# EAGLE design connector (EAGLE 9.5.2)
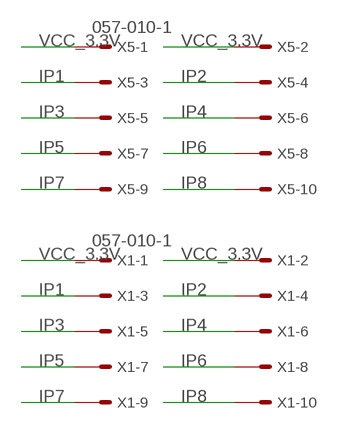
[diagram p0: schematic, sheet 1]

## Parts
X1  057-010-1  [057-010-1]
X5  057-010-1  [057-010-1]

## Nets
IP1: X1.3 X5.3
IP2: X1.4 X5.4
IP3: X1.5 X5.5
IP4: X1.6 X5.6
IP5: X1.7 X5.7
IP6: X1.8 X5.8
IP7: X1.9 X5.9
IP8: X1.10 X5.10
VCC_3.3V: X1.1 X1.2 X5.1 X5.2

## Library data of the parts
X1 X5 = con-panduit:057-010-: CONNECTOR 10-pin series 057 contact pc board low profile headers; OC_FARNELL: unknown; OC_NEWARK: unknown

## Board
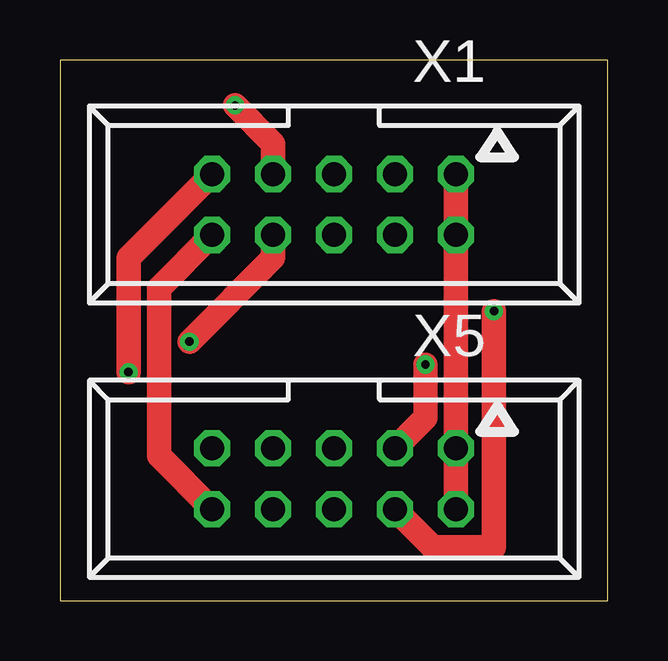
[diagram p1: board, top side]
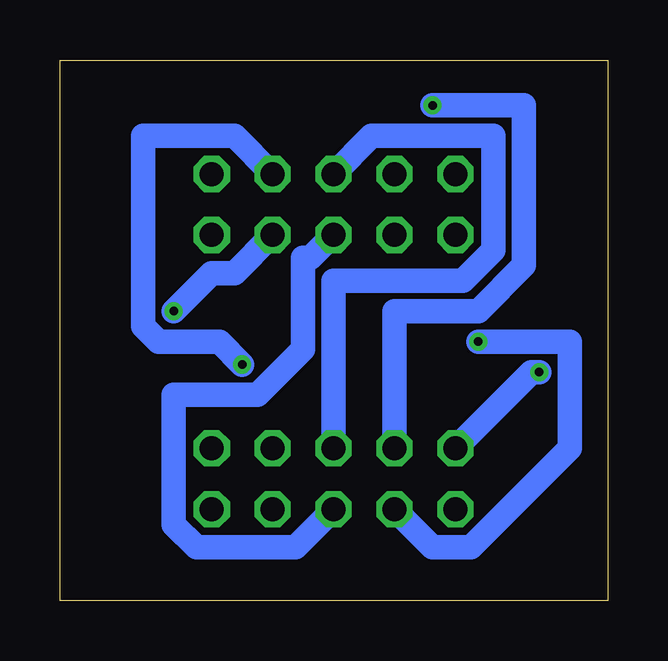
[diagram p2: board, bottom side, seen from below]

Size 22.84 x 22.53 mm. Coordinates in mm from the lower left corner, seen from the top.
Outline: 0,0 22.84,0 22.84,22.53 0,22.53 0,0
Copper layers (1*16): Top 0.035mm / dielectric 1.5mm / Bottom 0.035mm
Design rules "default *": minimum track width 40mil, minimum drill 0.35mm, track to track 6mil, track to pad 6mil, pad to pad 6mil, via to via 6mil, smd to smd 6mil, copper to edge 40mil, drill to drill 6mil, minimum pad ring 10mil, minimum via ring 8mil, stop-mask expansion 4mil, vias tented up to drill 0mil, thermal gap 10mil

### Footprints (pad centres in the part's own frame; a part is rotated, then mirrored left to right if it is on the bottom)
057-010-1 = drill 1 octagon: 1 -5.08,-1.27; 2 -5.08,1.27; 3 -2.54,-1.27; 4 -2.54,1.27; 5 0,-1.27; 6 0,1.27; 7 2.54,-1.27; 8 2.54,1.27; 9 5.08,-1.27; 10 5.08,1.27

### Placement (x,y rotation side)
X1  11.43,16.51 180 top
X5  11.43,5.08 180 top

### Tracks (layer width: path | path; a pad name or v marks a point on that pad's centre or on a via)
IP1  (via drill 0.35)
  Top 1.016: X5.3 15.24,7.62 v15.24,9.84
  Bottom 1.016: v15.24,9.84 16.19,10.79 18.73,10.79 19.37,11.43 19.37,19.37 15.56,19.37 X1.3
IP2  (via drill 0.35)
  Top 1.016: X5.4 15.56,2.22 18.1,2.22 v18.1,12.06
  Bottom 1.016: v18.1,12.06 16.51,13.65 15.56,13.65 X1.4
IP3
  Bottom 1.016: X5.5 11.43,13.34 6.03,13.34 4.76,14.61 4.76,19.37 9.84,19.37 X1.5
IP4
  Bottom 1.016: X5.6 13.02,2.22 17.14,2.22 18.1,3.17 18.1,8.57 14.61,8.57 12.7,10.48 12.7,14.29 12.38,14.29 X1.6
IP5  (via drill 0.35)
  Top 1.016: v7.3,20.64 8.89,19.05 X1.7
  Bottom 1.016: X5.7 8.89,12.06 5.4,12.06 3.49,13.97 3.49,20.64 v7.3,20.64
IP6  (via drill 0.35)
  Top 1.016: v5.4,10.79 8.89,14.29 X1.8
  Bottom 1.016: X5.8 7.3,2.22 5.71,2.22 1.59,6.35 1.59,10.79 v5.4,10.79
IP7  (via drill 0.35)
  Top 1.016: v2.86,9.53 2.86,14.29 X1.9
  Bottom 1.016: X5.9 3.17,9.53 v2.86,9.53
IP8
  Top 1.016: X5.10 4.13,6.03 4.13,13.02 X1.10
VCC_3.3V
  Top 1.016: X5.2 X5.1 X1.2 X1.1